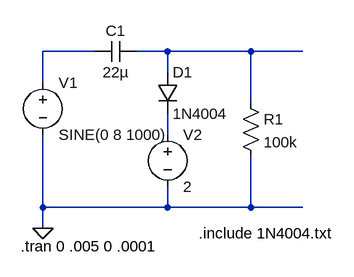
[diagram p0: schematic Lab4Pre3.asc]
Lab4Pre3.asc, the LTspice schematic file:
Version 4
SHEET 1 880 680
WIRE 128 64 48 64
WIRE 240 64 192 64
WIRE 368 64 240 64
WIRE 448 64 368 64
WIRE 240 96 240 64
WIRE 48 112 48 64
WIRE 368 144 368 64
WIRE 240 192 240 160
WIRE 48 304 48 192
WIRE 240 304 240 272
WIRE 240 304 48 304
WIRE 368 304 368 224
WIRE 368 304 240 304
WIRE 448 304 368 304
WIRE 48 336 48 304
FLAG 48 336 0
SYMBOL voltage 48 96 R0
WINDOW 123 0 0 Left 2
WINDOW 39 0 0 Left 2
SYMATTR InstName V1
SYMATTR Value SINE(0 8 1000)
SYMBOL voltage 240 176 R0
WINDOW 123 0 0 Left 2
WINDOW 39 0 0 Left 2
SYMATTR InstName V2
SYMATTR Value 2
SYMBOL cap 192 48 R90
WINDOW 0 0 32 VBottom 2
WINDOW 3 32 32 VTop 2
SYMATTR InstName C1
SYMATTR Value 22µ
SYMBOL diode 224 96 R0
SYMATTR InstName D1
SYMATTR Value 1N4004
SYMBOL res 352 128 R0
SYMATTR InstName R1
SYMATTR Value 100k
TEXT 288 344 Left 2 !.include 1N4004.txt
TEXT 14 364 Left 2 !.tran 0 .005 0 .0001

The netlist it stands for:
* Lab4Pre3.asc
V1 N001 0 SINE(0 8 1000)
V2 N003 0 2
C1 N002 N001 22µ
D1 N002 N003 1N4004
R1 N002 0 100k
.model D D
.lib standard.dio
.include 1N4004.txt
.tran 0 .005 0 .0001
.backanno
.end